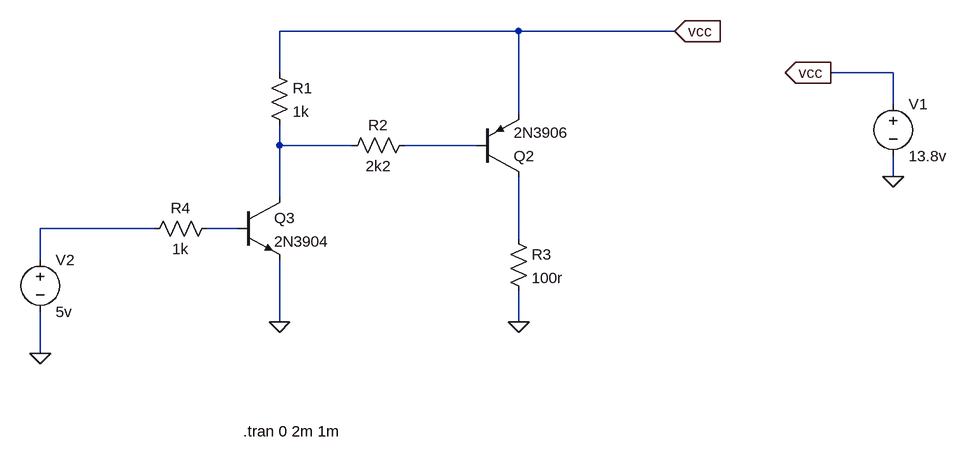
[diagram p0: schematic pnp_npn_high_side_sw.asc]
pnp_npn_high_side_sw.asc, the LTspice schematic file:
Version 4
SHEET 1 1164 680
WIRE 496 -288 128 -288
WIRE 736 -288 496 -288
WIRE 128 -224 128 -288
WIRE 1072 -224 976 -224
WIRE 1072 -176 1072 -224
WIRE 496 -160 496 -288
WIRE 128 -112 128 -144
WIRE 240 -112 128 -112
WIRE 432 -112 320 -112
WIRE 1072 -64 1072 -96
WIRE 128 -32 128 -112
WIRE -64 16 -240 16
WIRE 64 16 16 16
WIRE 496 32 496 -64
WIRE -240 64 -240 16
WIRE 128 160 128 64
WIRE 496 160 496 112
WIRE -240 208 -240 144
FLAG 736 -288 vcc
IOPIN 736 -288 In
FLAG 976 -224 vcc
IOPIN 976 -224 Out
FLAG 1072 -64 0
FLAG 496 160 0
FLAG 128 160 0
FLAG -240 208 0
SYMBOL pnp 432 -64 M180
SYMATTR InstName Q2
SYMATTR Value 2N3906
SYMBOL voltage 1072 -192 R0
WINDOW 123 0 0 Left 0
WINDOW 39 0 0 Left 0
SYMATTR InstName V1
SYMATTR Value 13.8v
SYMBOL res 112 -240 R0
SYMATTR InstName R1
SYMATTR Value 1k
SYMBOL res 480 16 R0
SYMATTR InstName R3
SYMATTR Value 100r
SYMBOL npn 64 -32 R0
SYMATTR InstName Q3
SYMATTR Value 2N3904
SYMBOL res 32 0 R90
WINDOW 0 0 56 VBottom 2
WINDOW 3 32 56 VTop 2
SYMATTR InstName R4
SYMATTR Value 1k
SYMBOL voltage -240 48 R0
WINDOW 123 0 0 Left 0
WINDOW 39 0 0 Left 0
SYMATTR InstName V2
SYMATTR Value 5v
SYMBOL res 336 -128 R90
WINDOW 0 0 56 VBottom 2
WINDOW 3 32 56 VTop 2
SYMATTR InstName R2
SYMATTR Value 2k2
TEXT 72 328 Left 2 !.tran 0 2m 1m

The netlist it stands for:
* pnp_npn_high_side_sw.asc
Q2 N005 N002 vcc 0 2N3906
V1 vcc 0 13.8v
R1 vcc N001 1k
R3 N005 0 100r
Q3 N001 N004 0 0 2N3904
R4 N004 N003 1k
V2 N003 0 5v
R2 N002 N001 2k2
.model NPN NPN
.model PNP PNP
.lib standard.bjt
.tran 0 2m 1m
.backanno
.end